# EAGLE design Breakout_20Pin_Wide (EAGLE 9.6.2)
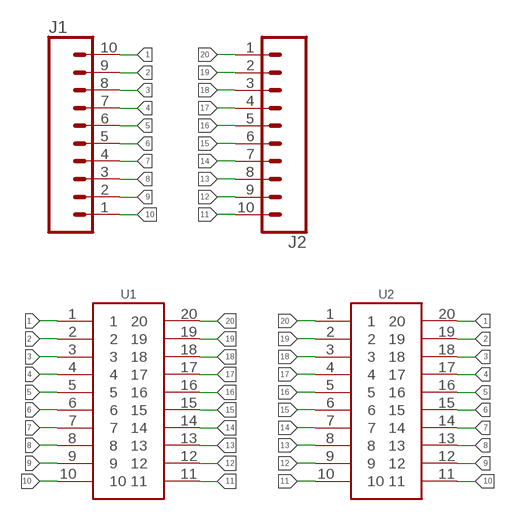
[diagram p0: schematic, sheet 1]

## Parts
J1  CONN_10"  [1X10]
J2  CONN_10"  [1X10]
U1  GEN_20SOIC_W  [SO-20DW]
U2  GEN_20SSOP  [SSOP20]

## Nets
1: J1.10 U1.1 U2.20
2: J1.9 U1.2 U2.19
3: J1.8 U1.3 U2.18
4: J1.7 U1.4 U2.17
5: J1.6 U1.5 U2.16
6: J1.5 U1.6 U2.15
7: J1.4 U1.7 U2.14
8: J1.3 U1.8 U2.13
9: J1.2 U1.9 U2.12
10: J1.1 U1.10 U2.11
11: J2.10 U1.11 U2.10
12: J2.9 U1.12 U2.9
13: J2.8 U1.13 U2.8
14: J2.7 U1.14 U2.7
15: J2.6 U1.15 U2.6
16: J2.5 U1.16 U2.5
17: J2.4 U1.17 U2.4
18: J2.3 U1.18 U2.3
19: J2.2 U1.19 U2.2
20: J2.1 U1.20 U2.1

## Library data of the parts
J1 J2 = bschulz:CONN_10: Genaric 10 terminal header Digikey 2.54_SCREW <https://www.digikey.com/product-detail/en/on-shore-technology-inc/OSTVN10A150/ED10567-ND/1588870> 3.5_SCREW <https://www.digikey.com/product-detail/en/on-shore-technology-inc/OSTTE100104/ED2735-ND/2351811>; PROD_ID: CONN-11563
U1 U2 = bschulz:GEN_20: Generic 14 Pin Package for Breakout Boards

## Board
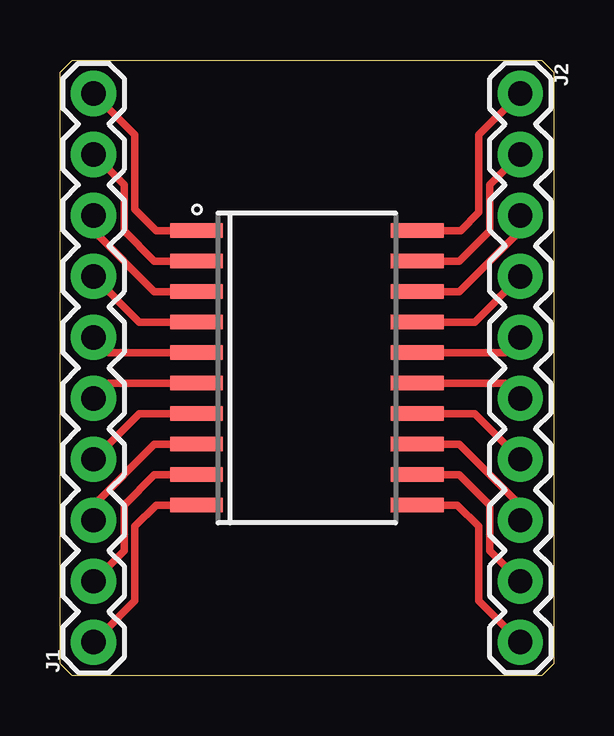
[diagram p1: board, top side]
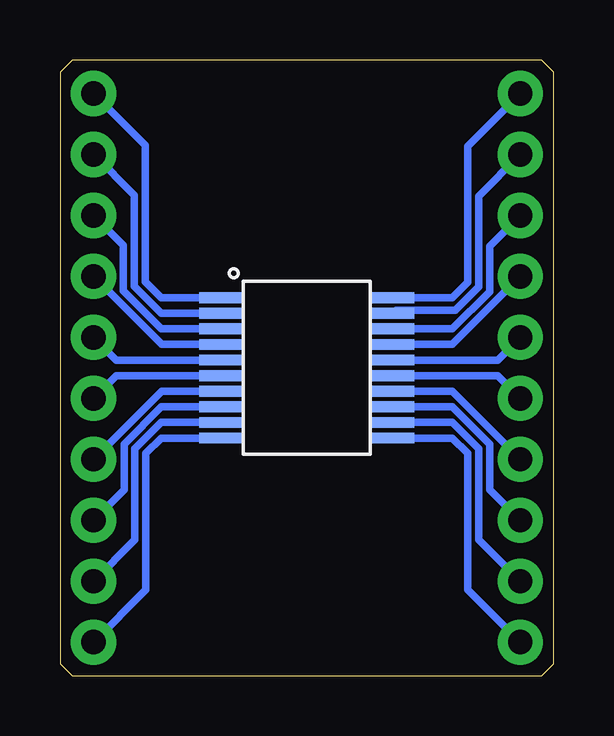
[diagram p2: board, bottom side, seen from below]

Size 20.57 x 25.65 mm. Coordinates in mm from the lower left corner, seen from the top.
Outline: 20.57,25.15 20.57,0.5 20.07,0 0.5,0 0,0.5 0,25.15 0.5,25.65 20.07,25.65 20.57,25.15
Copper layers (1*16): Top 0.035559375mm / dielectric 1.6mm / Bottom 0.035559375mm
Design rules "oshpark-2layer": minimum track width 6mil, minimum drill 10mil, track to track 6mil, track to pad 6mil, pad to pad 6mil, via to via 6mil, smd to smd 6mil, copper to edge 15mil, drill to drill 6mil, minimum pad ring 5mil, minimum via ring 5mil, stop-mask expansion 2.5mil, vias tented up to drill 0mil, thermal gap 10mil

### Footprints (pad centres in the part's own frame; a part is rotated, then mirrored left to right if it is on the bottom)
1X10 = drill 1.016 pad 1.88: 1 0,0; 2 2.54,0; 3 5.08,0; 4 7.62,0; 5 10.16,0; 6 12.7,0; 7 15.24,0; 8 17.78,0; 9 20.32,0; 10 22.86,0
SO-20DW = smd 0.6 x 2.2: 1 -5.715,-4.6; 2 -4.445,-4.6; 3 -3.175,-4.6; 4 -1.905,-4.6; 5 -0.635,-4.6; 6 0.635,-4.6; 7 1.905,-4.6; 8 3.175,-4.6; 9 4.445,-4.6; 10 5.715,-4.6; 11 5.715,4.6; 12 4.445,4.6; 13 3.175,4.6; 14 1.905,4.6; 15 0.635,4.6; 16 -0.635,4.6; 17 -1.905,4.6; 18 -3.175,4.6; 19 -4.445,4.6; 20 -5.715,4.6
SSOP20 = smd 0.45 x 1.75: 1 -2.925,-3.6; 2 -2.275,-3.6; 3 -1.625,-3.6; 4 -0.975,-3.6; 5 -0.325,-3.6; 6 0.325,-3.6; 7 0.975,-3.6; 8 1.625,-3.6; 9 2.275,-3.6; 10 2.925,-3.6; 11 2.925,3.6; 12 2.275,3.6; 13 1.625,3.6; 14 0.975,3.6; 15 0.325,3.6; 16 -0.325,3.6; 17 -0.975,3.6; 18 -1.625,3.6; 19 -2.275,3.6; 20 -2.925,3.6

### Placement (x,y rotation side)
J1  1.4,1.4 90 top
J2  19.18,24.26 270 top
U1  10.29,12.83 270 top
U2  10.29,12.83 270 bottom

### Tracks (layer width: path | path; a pad name or v marks a point on that pad's centre or on a via)
1
  Top 0.305: U1.1 4.01,18.54 3.12,19.43 3.12,22.53 J1.10
  Bottom 0.305: U2.20 4.22,15.75 3.59,16.39 3.59,22.07 J1.10
2
  Top 0.305: U1.2 3.94,17.27 2.67,18.54 2.67,20.45 J1.9
  Bottom 0.305: U2.19 6.57,15.22 4.11,15.22 3.13,16.2 3.13,19.98 J1.9
3
  Top 0.305: U1.3 3.94,16 1.4,18.54 J1.8
  Bottom 0.305: U2.18 4.23,14.45 2.67,16.01 2.67,17.9 J1.8
4
  Top 0.305: U1.4 3.3,14.73 J1.7
  Bottom 0.305: U2.17 4.23,13.8 J1.7
5
  Top 0.305: U1.5 2.03,13.46 J1.6
  Bottom 0.305: U2.16 2.34,13.15 J1.6
6
  Top 0.305: U1.6 2.03,12.19 J1.5
  Bottom 0.305: U2.15 2.34,12.5 J1.5
7
  Top 0.305: U1.7 3.3,10.92 J1.4
  Bottom 0.305: U2.14 4.23,11.85 J1.4
8
  Top 0.305: U1.8 3.94,9.65 1.4,7.11 J1.3
  Bottom 0.305: U2.13 4.23,11.2 2.67,9.65 2.67,7.75 J1.3
9
  Top 0.305: U1.9 3.94,8.38 2.67,7.11 2.67,5.21 J1.2
  Bottom 0.305: U2.12 4.22,10.55 3.13,9.46 3.13,5.67 J1.2
10
  Top 0.305: U1.10 4.01,7.11 3.12,6.22 3.12,3.12 J1.1
  Bottom 0.305: U2.11 4.22,9.9 3.59,9.27 3.59,3.59 J1.1
11
  Top 0.305: U1.11 16.56,7.11 17.45,6.22 17.45,3.12 J2.10
  Bottom 0.305: U2.10 16.35,9.9 16.99,9.26 16.99,3.58 J2.10
12
  Top 0.305: U1.12 16.62,8.38 17.91,7.1 17.91,5.21 J2.9
  Bottom 0.305: U2.9 16.35,10.55 17.45,9.45 17.45,5.66 J2.9
13
  Top 0.305: U1.13 16.64,9.65 19.18,7.11 J2.8
  Bottom 0.305: U2.8 16.34,11.2 17.91,9.64 17.91,7.75 J2.8
14
  Top 0.305: U1.14 17.27,10.92 J2.7
  Bottom 0.305: U2.7 16.34,11.85 J2.7
15
  Top 0.305: U1.15 18.54,12.19 J2.6
  Bottom 0.305: U2.6 18.23,12.5 J2.6
16
  Top 0.305: U1.16 18.54,13.46 J2.5
  Bottom 0.305: U2.5 18.23,13.15 J2.5
17
  Top 0.305: U1.17 17.27,14.73 J2.4
  Bottom 0.305: U2.4 16.34,13.8 J2.4
18
  Top 0.305: U1.18 16.64,16 19.18,18.54 J2.3
  Bottom 0.305: U2.3 16.34,14.45 17.93,16.04 17.93,17.93 J2.3
19
  Top 0.305: U1.19 16.64,17.27 17.91,18.54 17.91,20.45 J2.2
  Bottom 0.305: U2.2 16.35,15.1 17.48,16.23 17.48,20.02 J2.2
20
  Top 0.305: U1.20 16.69,18.54 17.45,19.3 17.45,22.53 J2.1
  Bottom 0.305: U2.1 16.35,15.75 17.02,16.42 17.02,22.1 J2.1

### Text on the board
tDocu: 1 | 20 | 2 | SOIC-20 / Wide | 19 | 3 | 18 | 4 | 17 | 5 | 16 | 6 | 15 | 7 | 14 | 8 | 13 | 9 | 12 | Bobby Schulz / Break44 | 10 | 11
bDocu: 20 | 1 | 19 | SSOP-20 | 2 | 18 | 3 | 17 | 4 | 16 | 5 | 15 | 6 | 14 | 7 | 13 | 8 | 12 | 9 | 11 | 10